# EAGLE design iron (EAGLE 9.4.2)
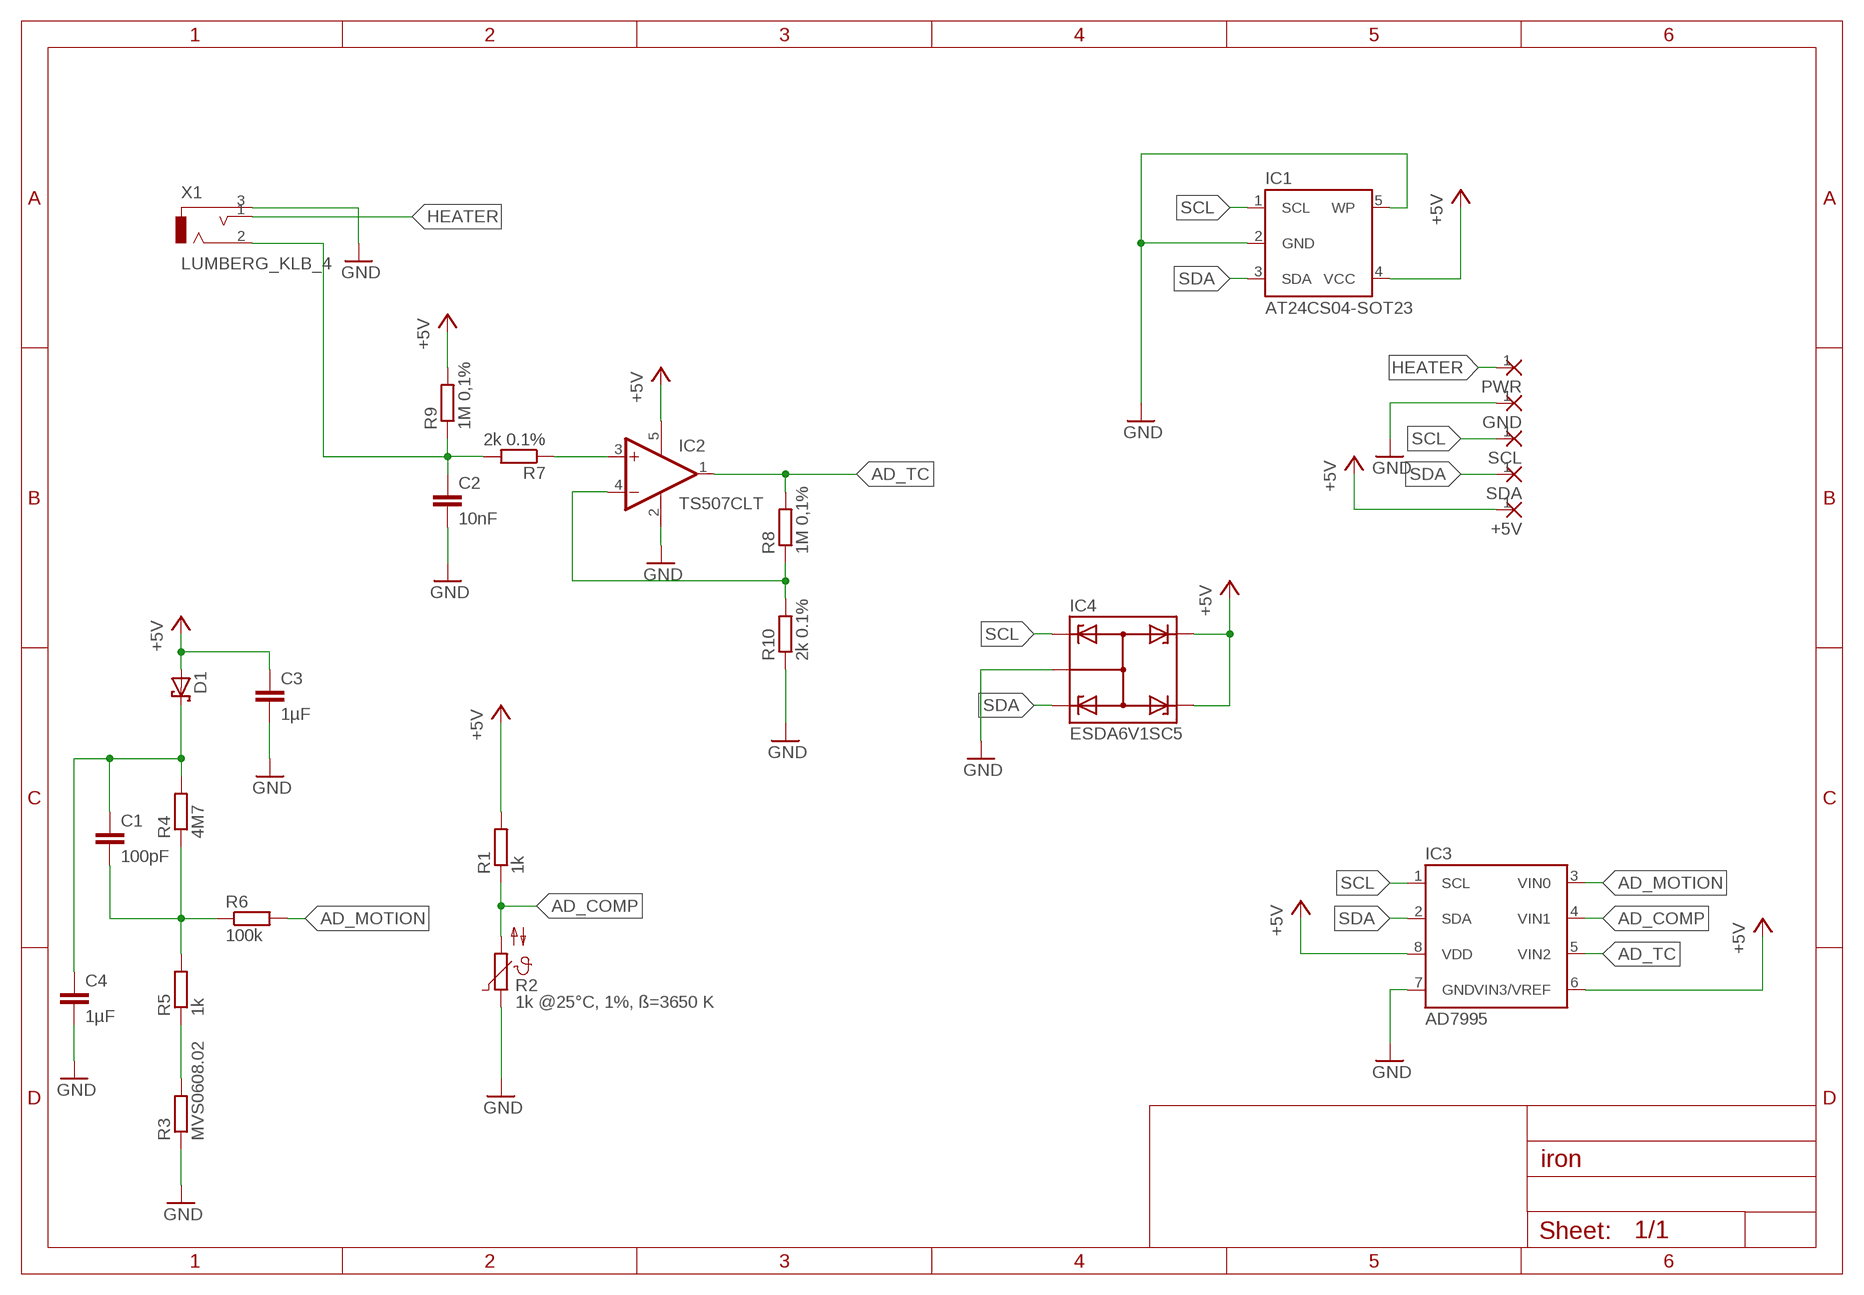
[diagram p0: schematic, sheet 1]

## Parts
+5V  1,6/0,8  [1,6/0,8]
C1  100pF  C-EU0603  [C0603]
C2  10nF  C-EU0603  [C0603]
C3  1µF  C-EU0603  [C0603]
C4  1µF  C-EU0603  [C0603]
D1  BAT54H  [SOD123-F]
GND  1,6/0,8  [1,6/0,8]
IC1  AT24CS04-SOT23  [SOT23-5L]
IC2  TS507CLT  [SOT23-5L]
IC3  AD7995  [SOT23-8]
IC4  ESDA6V1SC5  [SOT23-5L]
PWR  1,6/0,8  [1,6/0,8]
R1  1k  R-EU0603  [R0603]
R2  1k @25°C, 1%, ß=3650 K  NTC0603  [R0603]
R3  MVS0608.02  [VIBRA-SNS]
R4  4M7  R-EU0603  [R0603]
R5  1k  R-EU0603  [R0603]
R6  100k  R-EU0603  [R0603]
R7  2k 0.1%  R-EU0603  [R0603]
R8  1M 0,1%  R-EU0603  [R0603]
R9  1M 0,1%  R-EU0603  [R0603]
R10  2k 0.1%  R-EU0603  [R0603]
SCL  1,6/0,8  [1,6/0,8]
SDA  1,6/0,8  [1,6/0,8]
X1  LUMBERG_KLB_4  [3.5_MM_AUDIO_JACK]

## Nets
+5V: +5V.1(P) C3.1 D1.2(A) IC1.4(VCC) IC2.5(V+) IC3.6(VIN3/VREF) IC3.8(VDD) IC4.4 IC4.5 R1.2 R9.2
AD_COMP: IC3.4(VIN1) R1.1 R2.2
AD_MOTION: IC3.3(VIN0) R6.2
AD_TC: IC2.1(OUT) IC3.5(VIN2) R8.2
FEEDBACK: IC2.4(-IN) R8.1 R10.2
GND: C2.2 C3.2 C4.2 GND.1(P) IC1.2(GND) IC1.5(WP) IC2.2(V-) IC3.7(GND) IC4.2 R2.1 R3.P$1 R10.1 X1.3
HEATER: PWR.1(P) X1.1
MOTION_DIV: R3.P$2 R5.1
MOTION_FIL: C1.2 R4.1 R5.2 R6.1
N$1: C1.1 C4.1 D1.1(C) R4.2
SCL: IC1.1(SCL) IC3.1(SCL) IC4.1 SCL.1(P)
SDA: IC1.3(SDA) IC3.2(SDA) IC4.3 SDA.1(P)
THERMO_FIL: IC2.3(+IN) R7.1
THERMO_UNFIL: C2.1 R7.2 R9.1 X1.2

## Library data of the parts
+5V GND PWR SCL SDA = solderpi:1,6/0,8: THROUGH-HOLE PAD
C1 = common:C-EU; OC_DIGIKEY: 478-7926-1-ND
C2 = common:C-EU; OC_DIGIKEY: 478-6209-1-ND
C3 C4 = common:C-EU; OC_DIGIKEY: 1276-1034-1-ND
D1 = solderpi:BAT54H; OC_DIGIKEY: 1727-3569-1-ND
IC1 = solderpi:AT24CS04-SOT23; OC_DIGIKEY: AT24CS04-STUM-TCT-ND
IC2 = solderpi:TS507CLT; OC_DIGIKEY: 497-6944-1-ND
IC3 = solderpi:AD7995; OC_DIGIKEY: AD7995YRJZ-0500RL7CT-ND
IC4 = solderpi:ESDA6V1SC5; OC_DIGIKEY: 497-7748-1-ND
R1 = common:R-EU; OC_DIGIKEY: P1.0KDBCT-ND
R2 = common:NTC; OC_DIGIKEY: P123687CT-ND
R3 = solderpi:MVS0608.02
R4 = common:R-EU; OC_DIGIKEY: 311-4.70MHRCT-ND
R5 = common:R-EU; OC_DIGIKEY: RMCF0603FT1K00CT-ND
R6 = common:R-EU; OC_DIGIKEY: RMCF0603FT100KCT-ND
R7 R10 = common:R-EU; OC_DIGIKEY: TNP2.00KAACT-ND
R8 R9 = common:R-EU; OC_DIGIKEY: YAG4498CT-ND
X1 = solderpi:LUMBERG_KLB_4; OC_DIGIKEY: 486-3419-ND

## Board
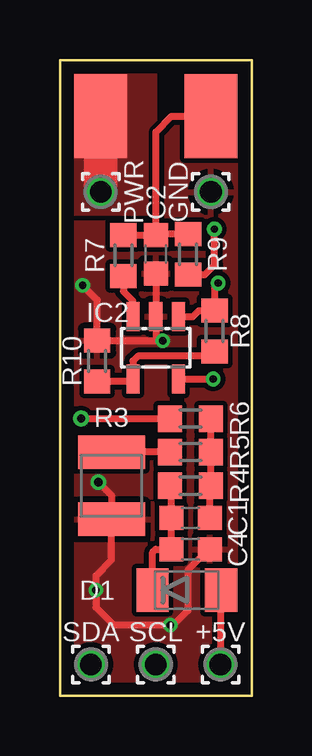
[diagram p1: board, top side]
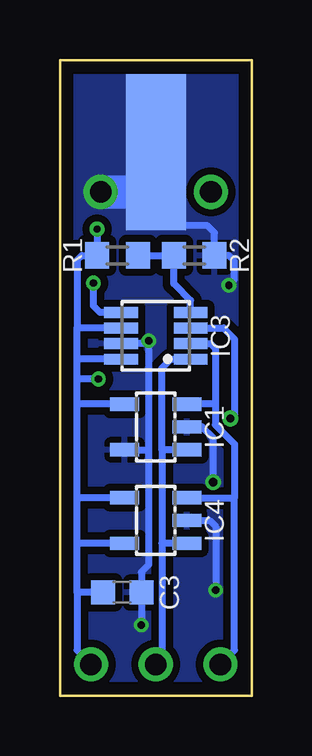
[diagram p2: board, bottom side, seen from below]

Size 8 x 26.5 mm. Coordinates in mm from the lower left corner, seen from the top.
Outline: 8,0 8,26.5 0,26.5 0,0 8,0
Copper layers (1*16): Top 0.035mm / dielectric 1.6mm / Bottom 0.035mm
Design rules "Elecrow_2-layer_PCB_eagle_rule *": minimum track width 6mil, minimum drill 12mil, track to track 6mil, track to pad 6mil, pad to pad 6mil, via to via 8mil, smd to smd 0mil, copper to edge 20mil, drill to drill 10mil, minimum pad ring 6mil, minimum via ring 6mil, stop-mask expansion 0mil, vias tented up to drill 100mil, thermal gap 10mil

### Footprints (pad centres in the part's own frame; a part is rotated, then mirrored left to right if it is on the bottom)
1,6/0,8 = drill 0.9 pad 1.422: 1 0,0
C0603 = smd 1 x 1: 1 -0.8,0; 2 0.8,0
SOD123-F = smd 1.34 x 1.8: 1 -1.43,0; 2 1.43,0
SOT23-5L = smd 0.55 x 1.2: 1 -0.95,-1.3; 2 0,-1.3; 3 0.95,-1.3; 4 0.95,1.3; 5 -0.95,1.3
SOT23-8 = smd 0.45 x 1.4: 1 -0.975,-1.45; 2 -0.325,-1.45; 3 0.325,-1.45; 4 0.975,-1.45; 5 0.975,1.45; 6 0.325,1.45; 7 -0.325,1.45; 8 -0.975,1.45
R0603 = smd 1 x 1.1: 1 -0.85,0; 2 0.85,0
VIBRA-SNS = smd 1.4 x 2.8: P$1 -1.4,0; P$2 1.4,0
3.5_MM_AUDIO_JACK = smd 2.2 x 3.5 bottom: 1 2.3,-1.75; 2 -2.3,-1.75 | smd 2.5 x 6.5: 3 0,-3.25

### Placement (x,y rotation side)
+5V  6.7,1.3 0 top
C1  5.45,7.4 0 top
C2  4,18.4 270 top
C3  5.4,4.3 0 bottom
C4  5.45,6.1 0 top
D1  5.3,4.4 0 top
GND  6.3,21 0 top
IC1  4,11.2 90 bottom
IC2  4,14.5 180 top
IC3  4,15 90 bottom
IC4  4,7.3 90 bottom
PWR  1.7,21 0 top
R1  5.6,18.35 180 bottom
R2  2.4,18.35 180 bottom
R3  2.15,8.75 90 top
R4  5.45,8.75 180 top
R5  5.45,10.15 0 top
R6  5.45,11.55 180 top
R7  2.65,18.35 90 top
R8  6.45,15.2 90 top
R9  5.35,18.4 270 top
R10  1.55,13.95 270 top
SCL  4,1.3 0 top
SDA  1.3,1.3 0 top
X1  4,25.9 0 bottom

### Tracks (layer width: path | path; a pad name or v marks a point on that pad's centre or on a via)
+5V  (via drill 0.3)
  Top 0.3: R9.2 6.05,17.55 6.45,17.95 v6.45,19.45 | IC2.5 v6.4,13.2 | D1.2 6.7,4.37 +5V.1
  Bottom 0.3: v6.45,19.45 R1.2 7.09,18.35 7.29,18.15 7.29,15.32 | IC3.6 7.29,15.32 | 7.29,8.25 7.29,12.15 | 7.29,12.15 7.29,13.2 | 7.29,13.2 7.29,14.03 | 7.29,14.03 7.29,15.32 | IC3.8 7.29,14.03 | IC1.4 7.29,12.15 | v6.4,13.2 7.29,13.2 | IC4.4 7.29,8.25 | IC4.5 7.29,6.35 | 7.29,6.35 7.29,8.25 | +5V.1 7.29,1.89 7.29,4.3 | C3.1 7.29,4.3 | 7.29,4.3 7.29,6.35
AD_COMP
  Bottom 0.3: IC3.4 2.55,16.48 3.25,17.18 R2.2 R1.1
AD_MOTION  (via drill 0.35)
  Top 0.3: v0.89,11.55 R6.2
  Bottom 0.3: IC3.3 1.18,15.32 0.71,14.86 0.71,11.73 v0.89,11.55
AD_TC  (via drill 0.3)
  Top 0.3: v6.6,17.2 6.45,17.05 R8.2 5.8,16.05 5.55,15.8 IC2.1
  Bottom 0.3: IC3.5 6.33,15.97 6.6,16.25 v6.6,17.2
FEEDBACK
  Top 0.3: R10.2 2.95,13.1 IC2.4 3.05,13.95 3.25,14.15 6.25,14.15 R8.1
GND  (via drill 0.3, 0.35)
  Top 0.3: C2.2 IC2.2 4,14.8 | v0.95,17.1 1.55,16.5 R10.1 4,14.8 | 4,14.8 v4.29,14.8 v4.29,14.79 | v1.6,8.9 2.15,8.35 R3.P$1 2.15,5.65 1.5,5 v1.5,4.4 1.5,3.67 2.23,2.94 v4.6,2.94 4.74,2.94 5.35,3.55 5.35,5.25 6.2,6.1 C4.2
  Bottom 0.3: X1.3 4,21.5 4,20.32 3.27,19.59 1.84,19.59 1.55,19.3 R2.1 0.95,18.35 0.75,18.15 0.75,17.3 v0.95,17.1 | IC3.7 4.42,14.68 v4.29,14.79 4.29,10.25 | v1.6,8.9 1.6,10.73 2.07,11.2 IC1.2 | IC1.5 4.29,10.25 | IC4.2 1.75,7.3 1.5,7.05 v1.5,4.4 | 4.29,10.25 4.29,5.46 4.6,5.15 C3.2 v4.6,2.94
  Bottom 1.4: GND.1 4,21 4,21.5
  pour Top (isolate 0.2, rank 2): 0,26.5 0,0 8,0 8,26.5
  pour Bottom (isolate 0.305, rank 2): 0,19.65 0,0.5 8,0.5 8,19.65
  pour Bottom (isolate 0.305, no thermals): 0,26.5 0,19.05 8,19.05 8,26.5
HEATER
  Top 1.4: PWR.1 X1.1
  pour Top (no thermals): 0,26.5 4,26.5 4,20.05 0,20.05
MOTION_DIV
  Top 0.3: R5.1 R3.P$2
MOTION_FIL
  Top 0.3: C1.2 6.25,8.75 R4.1 R5.2 R6.1
N$1
  Top 0.3: R4.2 4.65,8.75 C1.1 C4.1 4,6.1 3.87,5.97 D1.1
SCL
  Bottom 0.3: 3.75,10.25 3.75,6.35 | IC3.1 3.38,14.03 3.75,13.65 3.75,10.25 | IC1.1 3.75,10.25 | IC4.1 3.75,6.35 | SCL.1 3.75,1.55 3.75,6.35
SDA
  Bottom 0.3: IC3.2 1.73,14.68 1.52,14.47 1.52,12.15 | 1.52,12.15 IC1.3 | 1.52,12.15 1.52,11.29 0.71,10.48 0.71,8.25 | IC4.3 0.71,8.25 | SDA.1 0.71,1.89 0.71,8.25
THERMO_FIL
  Top 0.3: IC2.3 3.05,16.45 2.65,16.85 R7.1
THERMO_UNFIL
  Top 0.3: R7.2 C2.1 | R9.1 4.05,19.25 C2.1 | X1.2 4.65,24.15 4,23.5 C2.1